# Altium schematic sheet 06_SODIMM connector 3_3.SchDoc: C200
size 594 x 420 mm; Page Create Date: March  8, 1995; Page Number: 6; Page Size: A2; Comment: radxa_1010; Page Count: 21; RevCode: V1.11; Doc: 06_SODIMM connector 3_3; DsnPath: D:\WMS\C200\CC122\对外\C200 V1.11.DSN; SchematicName: c200; PageName: 06_SODIMM connector 3_3; PageSize: A2; TopSchematic: True
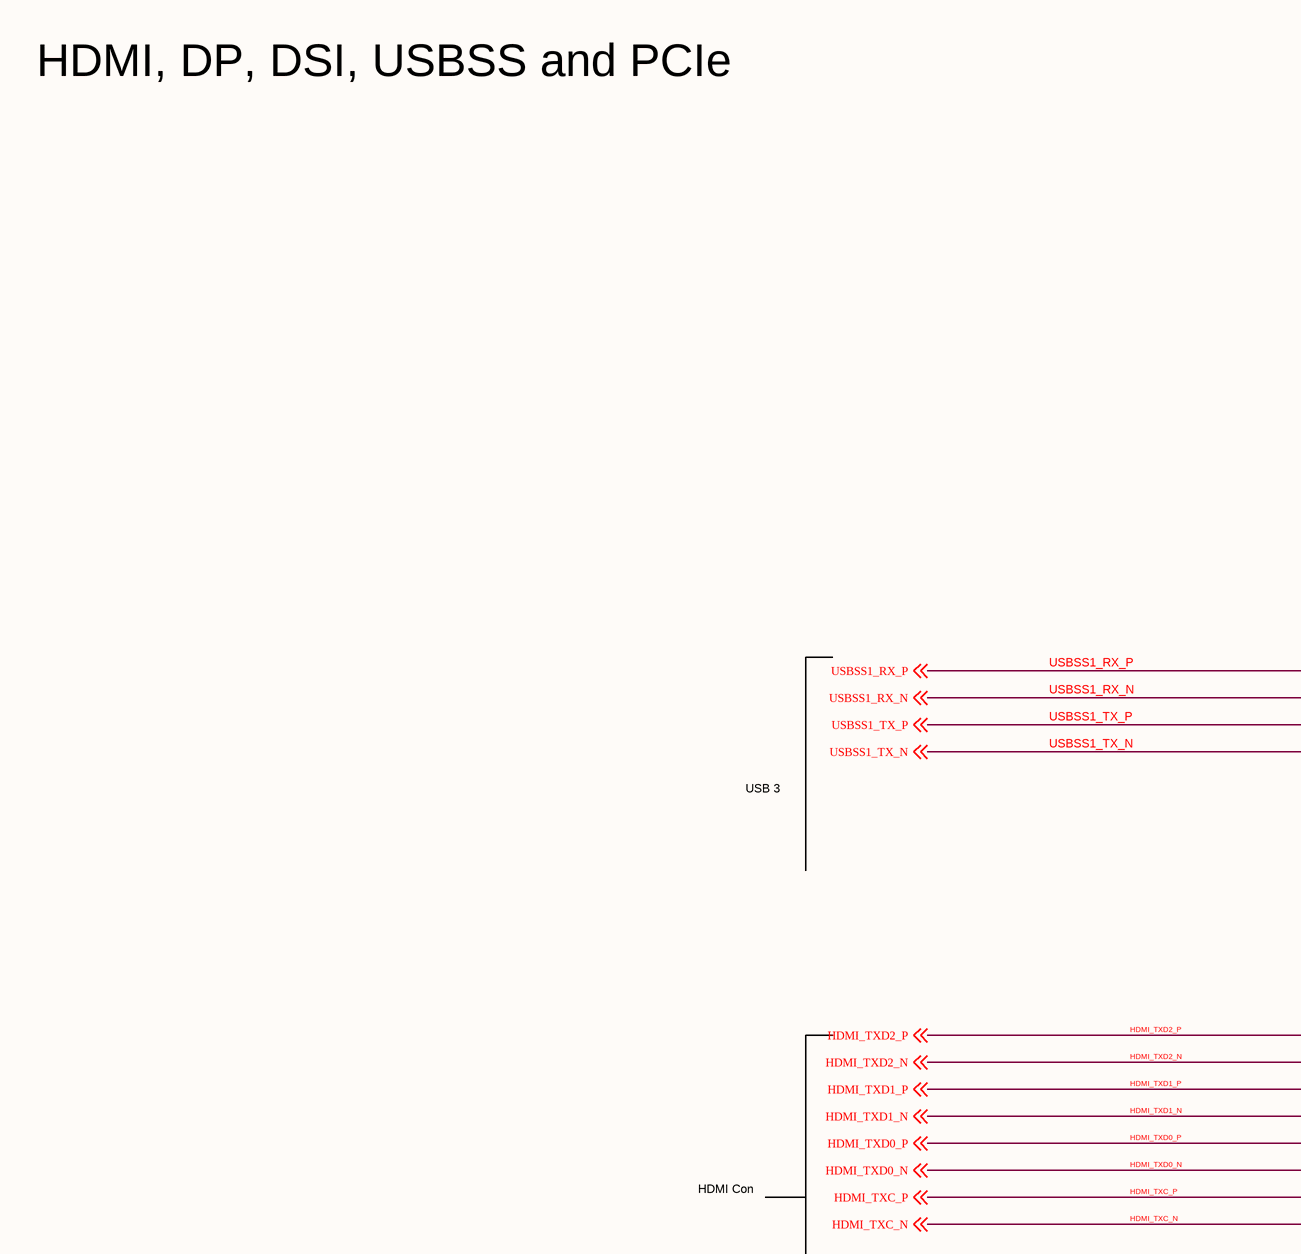
[diagram p0: 06_SODIMM connector 3_3.SchDoc, top left]
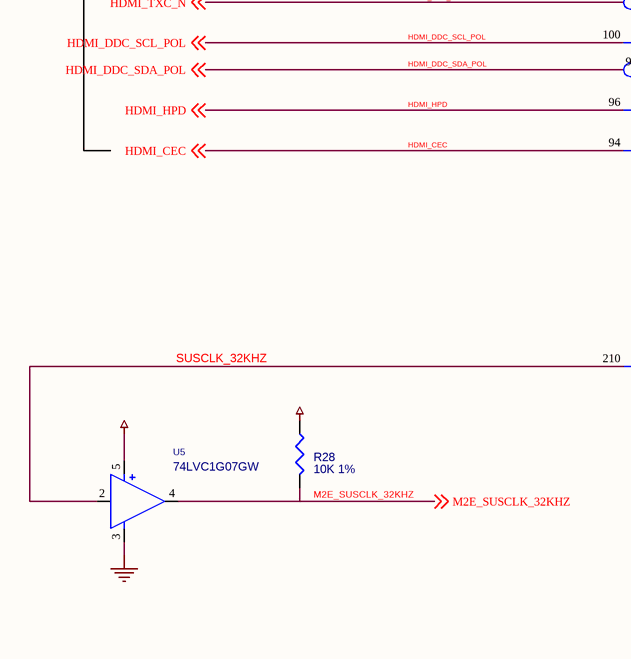
[diagram p1: 06_SODIMM connector 3_3.SchDoc, bottom left]
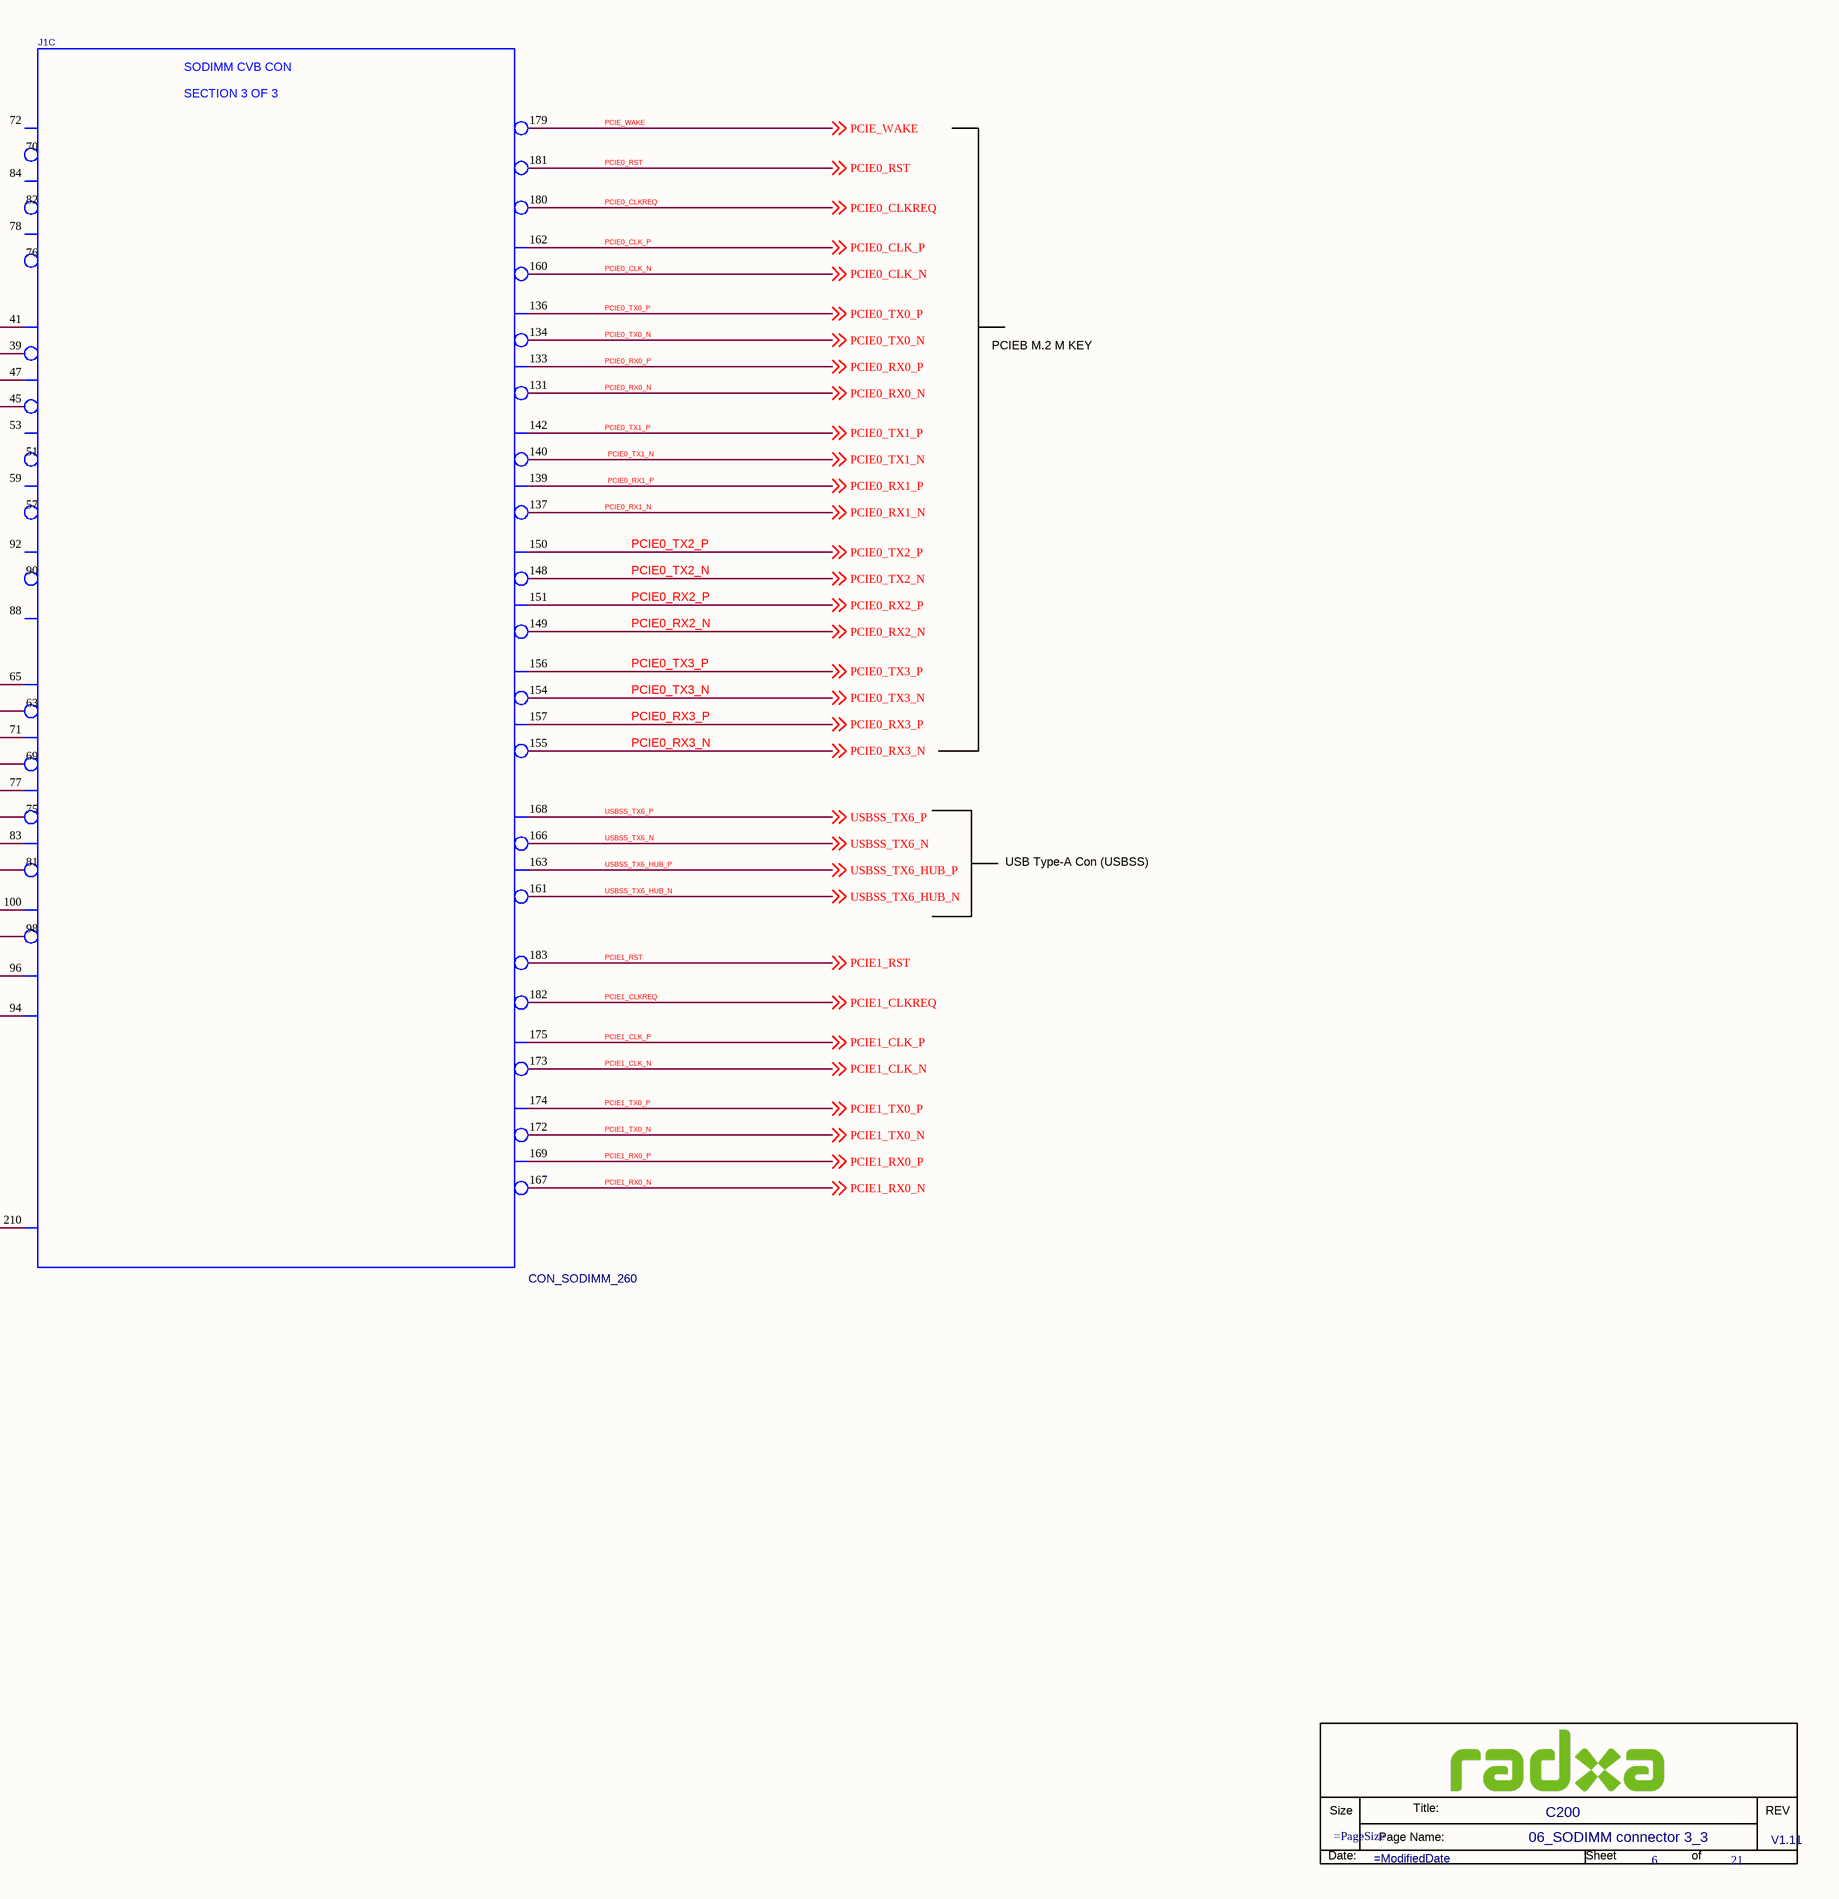
[diagram p2: 06_SODIMM connector 3_3.SchDoc, bottom right]

## Parts
*  Doc: 06_SODIMM connector 3_3  RevCode: V1.11  Title: C200  Page Number: 6  Page Count: 21  (hidden comment: radxa_1010)  (graphical)
J1  CON_SODIMM_260  [SODIMM_SM260_0D5_78D0X26D1]  (part C of 3)
R28  10K 1%  [R0402]
U5  74LVC1G07GW  [SC70_5]

## Nets
GND: U5.3(GND)
VDD_1V8: U5.5(VCC)
VDD_3V3_SYS: R28.1
HDMI_CEC: J1.94(HDMI_CEC) ; off-sheet HDMI_CEC
HDMI_DDC_SCL_POL: J1.100(DP_AUX_CH1_P) ; off-sheet HDMI_DDC_SCL_POL
HDMI_DDC_SDA_POL: J1.98(DP_AUX_CH1_N) ; off-sheet HDMI_DDC_SDA_POL
HDMI_HPD: J1.96(HDMI_INT_DP_HPD) ; off-sheet HDMI_HPD
HDMI_TXC_N: J1.81(HDMI_TXC_N) ; off-sheet HDMI_TXC_N
HDMI_TXC_P: J1.83(HDMI_TXC_P) ; off-sheet HDMI_TXC_P
HDMI_TXD0_N: J1.75(HDMI_TXD2_N) ; off-sheet HDMI_TXD0_N
HDMI_TXD0_P: J1.77(HDMI_TXD2_P) ; off-sheet HDMI_TXD0_P
HDMI_TXD1_N: J1.69(HDMI_TXD1_N) ; off-sheet HDMI_TXD1_N
HDMI_TXD1_P: J1.71(HDMI_TXD1_P) ; off-sheet HDMI_TXD1_P
HDMI_TXD2_N: J1.63(HDMI_TXD0_N) ; off-sheet HDMI_TXD2_N
HDMI_TXD2_P: J1.65(HDMI_TXD0_P) ; off-sheet HDMI_TXD2_P
M2E_SUSCLK_32KHZ: R28.2 U5.4(Y) ; off-sheet M2E_SUSCLK_32KHZ
PCIE0_CLK_N: J1.160(PEX_CLK1_N) ; off-sheet PCIE0_CLK_N
PCIE0_CLK_P: J1.162(PEX_CLK1_P) ; off-sheet PCIE0_CLK_P
PCIE0_CLKREQ: J1.180(PEX_L0_CLKREQ) ; off-sheet PCIE0_CLKREQ
PCIE0_RST: J1.181(PEX_L0_RST) ; off-sheet PCIE0_RST
PCIE0_RX0_N: J1.131(PEX_RX4_N) ; off-sheet PCIE0_RX0_N
PCIE0_RX0_P: J1.133(PEX_RX4_P) ; off-sheet PCIE0_RX0_P
PCIE0_RX1_N: J1.137(PEX_RX3_N) ; off-sheet PCIE0_RX1_N
PCIE0_RX1_P: J1.139(PEX_RX3_P) ; off-sheet PCIE0_RX1_P
PCIE0_RX2_N: J1.149(PEX_RX2_N) ; off-sheet PCIE0_RX2_N
PCIE0_RX2_P: J1.151(PEX_RX2_P) ; off-sheet PCIE0_RX2_P
PCIE0_RX3_N: J1.155(PEX_RX1_N) ; off-sheet PCIE0_RX3_N
PCIE0_RX3_P: J1.157(PEX_RX1_P) ; off-sheet PCIE0_RX3_P
PCIE0_TX0_N: J1.134(PEX_TX4_N) ; off-sheet PCIE0_TX0_N
PCIE0_TX0_P: J1.136(PEX_TX4_P) ; off-sheet PCIE0_TX0_P
PCIE0_TX1_N: J1.140(PEX_TX3_N) ; off-sheet PCIE0_TX1_N
PCIE0_TX1_P: J1.142(PEX_TX3_P) ; off-sheet PCIE0_TX1_P
PCIE0_TX2_N: J1.148(PEX_TX2_N) ; off-sheet PCIE0_TX2_N
PCIE0_TX2_P: J1.150(PEX_TX2_P) ; off-sheet PCIE0_TX2_P
PCIE0_TX3_N: J1.154(PEX_TX1_N) ; off-sheet PCIE0_TX3_N
PCIE0_TX3_P: J1.156(PEX_TX1_P) ; off-sheet PCIE0_TX3_P
PCIE1_CLK_N: J1.173(PEX_CLK2_N) ; off-sheet PCIE1_CLK_N
PCIE1_CLK_P: J1.175(PEX_CLK2_P) ; off-sheet PCIE1_CLK_P
PCIE1_CLKREQ: J1.182(PEX_L1_CLKREQ) ; off-sheet PCIE1_CLKREQ
PCIE1_RST: J1.183(PEX_L1_RST) ; off-sheet PCIE1_RST
PCIE1_RX0_N: J1.167(PEX_RX0_N) ; off-sheet PCIE1_RX0_N
PCIE1_RX0_P: J1.169(PEX_RX0_P) ; off-sheet PCIE1_RX0_P
PCIE1_TX0_N: J1.172(PEX_TX0_N) ; off-sheet PCIE1_TX0_N
PCIE1_TX0_P: J1.174(PEX_TX0_P) ; off-sheet PCIE1_TX0_P
PCIE_WAKE: J1.179(PEX_WAKE) ; off-sheet PCIE_WAKE
SUSCLK_32KHZ: J1.210(CLK_32K_OUT) U5.2(A)
USBSS1_RX_N: J1.39(EDP_TXD0_N) ; off-sheet USBSS1_RX_N
USBSS1_RX_P: J1.41(EDP_TXD0_P) ; off-sheet USBSS1_RX_P
USBSS1_TX_N: J1.45(EDP_TXD1_N) ; off-sheet USBSS1_TX_N
USBSS1_TX_P: J1.47(EDP_TXD1_P) ; off-sheet USBSS1_TX_P
USBSS_TX6_HUB_N: J1.161(PEX_RX6_N) ; off-sheet USBSS_TX6_HUB_N
USBSS_TX6_HUB_P: J1.163(PEX_RX6_P) ; off-sheet USBSS_TX6_HUB_P
USBSS_TX6_N: J1.166(PEX_TX6_N) ; off-sheet USBSS_TX6_N
USBSS_TX6_P: J1.168(PEX_TX6_P) ; off-sheet USBSS_TX6_P

Not connected (* = marked no-connect by the designer): J1 51(EDP_TXD2_N) 53(EDP_TXD2_P) 57(EDP_TXD3_N) 59(EDP_TXD3_P) 70(DSI_A_D0_N) 72(DSI_A_D0_P) 76(DSI_A_CLK_N) 78(DSI_A_CLK_P) 82(DSI_A_D1_N) 84(DSI_A_D1_P) 88(DP_HPD) 90(DP_AUX_CH0_N) 92(DP_AUX_CH0_P)

## Notes on the sheet
- HDMI, DP, DSI, USBSS and PCIe
- PCIEB M.2 M KEY
- USB 3
- HDMI Con
- USB Type-A Con (USBSS)
- (in symbol CON_SODIMM_260, part C) SODIMM CVB CON; SECTION 3 OF 3
- (in symbol radxa_1010) Size; Title:; REV; Page Name:; Date:; Sheet; of

## Library data of the parts
J1 = CON_SODIMM_260: SMD  母座  立贴  0.5mm脚距  AS0AA826-EASB0-7H  Foxconn  ROHS; Part Reference: J1; Part Number: A1J01.00015; CDS_PHYS_PART_NAME: CON_SODIMM_260_CON_SODIMM260_JETSON_NANO-2309413-1,FEMALE,0.5MM,90,[ ],[ ],YES,NO,NO,25 V,0.5 A,080-1656-000-080-1656-000; CDS_PART_NAME: CON_SODIMM_260_CON_SODIMM260_JETSON_NANO-2309413-1,FEMALE,0.5MM,90,[ ],[ ],YES,NO,NO,25 V,0.5 A,080-1656-000; ANGLE: 90; ASSEMBLY: CVB_CONN; EMI_GROUND_TAB: NO; GENDER: FEMALE; LATCHING: YES; MAX_CURRENT: 0.5 A; MAX_VOLTAGE: 25 V; NV_NAME: 2309413-1; NV_PN: 080-1656-000; PACK_TYPE: CON_SODIMM260_JETSON_NANO; PATH: I85; PITCH: 0.5mm; SHROUDED: [ ]; OriginalSymbolOrigin: (-950,2300); CaptureCellPackProp: CON_SODIMM_260C; SEC: 3; XY: (-6350,4050); VER: 8; ROT: 0; PHYS_PAGE: 6; DRAWING: @P3449_B01_LIB.P3449_B01(SCH_1):PAGE6; DEVICE_TYPENAME: CON_SODIMM_260_CON_SODIMM260_JETSON_NANO-2309413-1FEMALE05MM90YESNONO25V05A080-1656-000-080-1656-000; CDS_LIB: p3449_b01_lib; PLACEMENT_NOTE: ?; REFLOW: [ ]; SHIELDED: NO; SKU: COMMON; Value: CON_SODIMM_260; Part Type: 连接座; SEC_TYPE: CON_SODIMM260_JETSON_NANO; CHIPS_PART_NAME: CON_SODIMM_260; CDS_SEC: 3; PCB Footprint: SODIMM_SM260_0D5_78D0X26D1
R28 = R: SMD  0402  10K  1/16W  ±1%  ROHS; Part Reference: R28; Part Number: A1R01.00222; CDS_PHYS_PART_NAME: R_0402-10K,5 %,62.5MW,195-0486-000-10K,195-0486-000; CDS_PART_NAME: R_0402-10K,5 %,62.5MW,195-0486-000; SEC: 1; XY: (-8350,1250); VER: 2; TOL: 5%; SIGNAL_MODEL: nv_res; ROT: 0; PHYS_PAGE: 6; PATH: I87; PACK_TYPE: 402; NV_PN: 195-0486-000; MAX_WATTAGE: 62.5mW; LOCATION: R13; DRAWING: #NAME?; DEVICE_TYPENAME: R_0402-10K5625MW195-0486-000-10K195-0486-000; CDS_LIB: discrete; ASSEMBLY: M2_WIFIBT; PCB Footprint: R0402; Value: 10K 1%; Part Type: 贴片电阻; CHIPS_PART_NAME: R; CDS_SEC: 1
U5 = 74LVC1G07GW: SMD  缓冲器  74LVC1G07GW  SOT-353  TECH PUBLIC(台舟)  ROHS; Part Reference: U5; Part Number: A1I01.00080; OriginalSymbolOrigin: (-100,100); NC: 1; SKU: COMMON; PLACEMENT_NOTE: ?; PATH: ?; PACK_TYPE: ?; NV_PN: ?; NV_NAME: ?; FUNCTION: ?; ASSEMBLY: ?; Value: 74LVC1G07GW; Part Type: 集成电路/模块; PCB Footprint: SC70_5
* = radxa_1010: Page Create Date: March  8, 1995; Page Size: =PageSize; Page Modify Date: =ModifiedDate